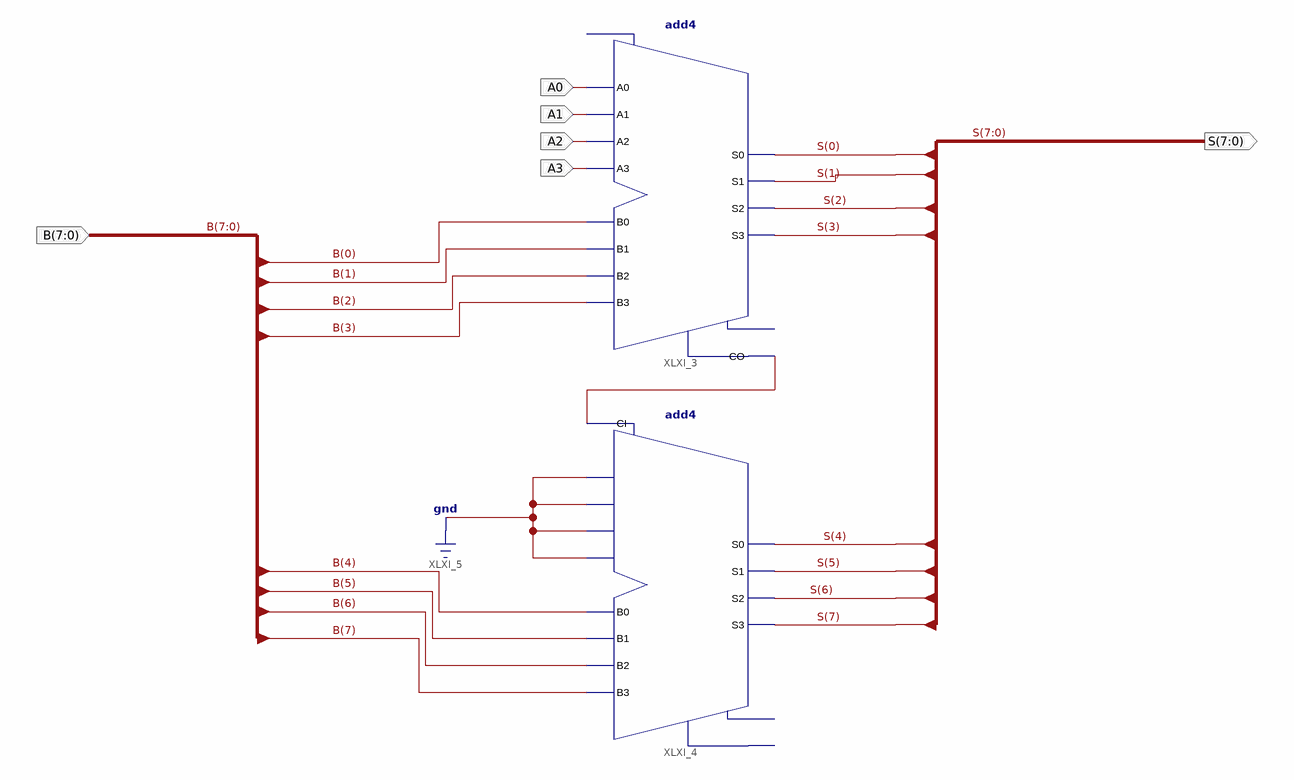
[diagram p0: schematic sheet 1]
// Xilinx ISE schematic ADD4with8bits.sch (spartan6) as structural Verilog: 2 symbols, 6 ports
module ADD4with8bits (
  input  [7:0] B,
  input  A0,
  input  A1,
  input  A2,
  input  A3,
  output [7:0] S
);

  wire XLXN_13;

  add4 XLXI_3 (
    .A0(A0), .A1(A1), .A2(A2), .A3(A3), .B0(B[0]), .B1(B[1]), .B2(B[2]), .B3(B[3]), .CO(XLXN_13), .S0(S[0]),
    .S1(S[1]), .S2(S[2]), .S3(S[3]));  // open: CI, OFL
  add4 XLXI_4 (
    .A0(1'b0), .A1(1'b0), .A2(1'b0), .A3(1'b0), .B0(B[4]), .B1(B[5]), .B2(B[6]), .B3(B[7]), .CI(XLXN_13),
    .S0(S[4]), .S1(S[5]), .S2(S[6]), .S3(S[7]));  // open: CO, OFL
endmodule
